# Altium project Sound-active Light.PrjPcb
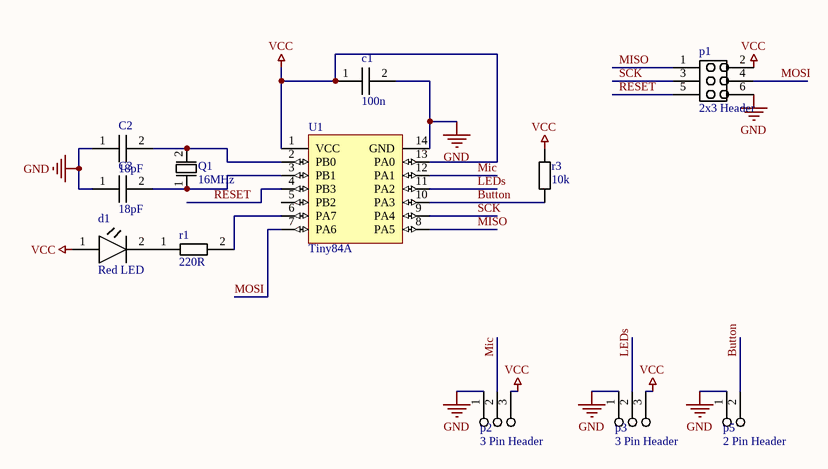
[diagram p0: µController.SchDoc]
2 sheets, 21 parts. Net scope: global (net labels, ports and power ports of the same name join across sheets).
Board file: SoundActiveLight.PcbDoc
Sheets:
  µController.SchDoc
  PowerSupply.SchDoc

## Sheet µController.SchDoc
size A4

### Parts
c1  100n  [0805]
C2  18pF  [0603]
C3  18pF  [0603]
d1  Red LED  [0805 - diode]
p1  2x3 Header  [2x3-HeaderPin]
p2  3 Pin Header  [1x3-HeaderPin]
p3  3 Pin Header  [1x3-HeaderPin]
p5  2 Pin Header  [1x2-HeaderPin]
Q1  16MHz  [Crystal 488P]
r1  220R  [0805]
r3  10k  [0603]
U1  Tiny84A  [SOIC14N]

### Nets
GND: c1.2 C2.1 C3.1 p1.6 p2.1 p3.1 p5.1 U1.14(GND)
VCC: c1.1 d1.1 p1.2 p2.3 p3.3 r3.2 U1.1(VCC) U1.13(PA0)
Button: p5.2 r3.1 U1.10(PA3)
LEDs: p3.2 U1.11(PA2)
Mic: p2.2 U1.12(PA1)
MISO: p1.1 U1.8(PA5)
MOSI: p1.4 U1.7(PA6)
RESET: p1.5 U1.4(PB3)
SCK: p1.3 U1.9(PA4)
NetC2_2: C2.2 Q1.2 U1.2(PB0)
NetC3_2: C3.2 Q1.1 U1.3(PB1)
Netd1_2: d1.2 r1.1
Netr1_2: r1.2 U1.6(PA7)

Not connected (* = marked no-connect by the designer): U1 5(PB2)

### Library data of the parts
c1 = 0805 Capacitor: ...F
C2 C3 = 0603 Capacitor: ...F
d1 = Red LED: Red diffused LED
p1 = 2x3 Header: Header Pin
p2 p3 = 3 Pin Header: Header Pin
Q1 = Crystal: ...MHz
r1 = 0805 Resistor: ...R
r3 = 0603 Resistor: ...R
U1 = ATTiny84A

## Sheet PowerSupply.SchDoc
size A4
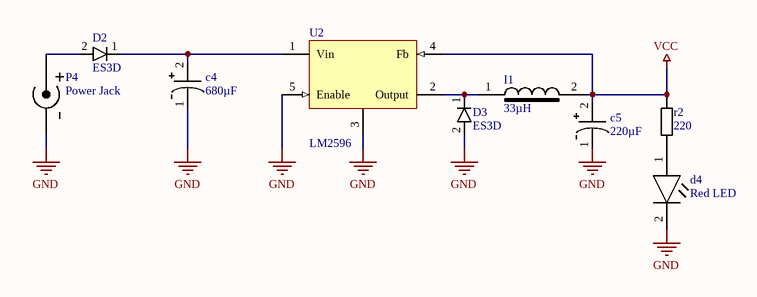
[diagram p1: PowerSupply.SchDoc]

### Parts
c4  680µF  [Elco-C]
c5  220µF  [Elco-C]
D2  ES3D  [DO-214AB (SMC)]
D3  ES3D  [DO-214AB (SMC)]
d4  Red LED  [0805 - diode]
I1  33µH  [DR125]
P4  Power Jack  [Power Jack]
r2  220  [0603]
U2  LM2596  [TO-263-5]

### Nets
GND: c4.1 c5.1 D3.2 d4.2 P4.2(GND) U2.3(GND) U2.5(Enable) U2.6
VCC: c5.2 I1.2 r2.2 U2.4(Fb)
Netc4_2: c4.2 D2.1 U2.1(Vin)
NetD2_2: D2.2 P4.1(V+)
NetD3_1: D3.1 I1.1 U2.2(Output)
Netd4_1: d4.1 r2.1

### Library data of the parts
c4 c5 = Elco G
D2 D3 = ES3D: ES3D diode
d4 = Red LED: Red diffused LED
I1 = Inductor: Inductor with Ferrite core
r2 = 0603 Resistor: ...R
U2 = LM2596: LM2596 Switching Voltage Regulator

## Nets that join several sheets
GND: µController (8 pins), PowerSupply (8 pins)
VCC: µController (8 pins), PowerSupply (c5.2 I1.2 r2.2 U2.4)